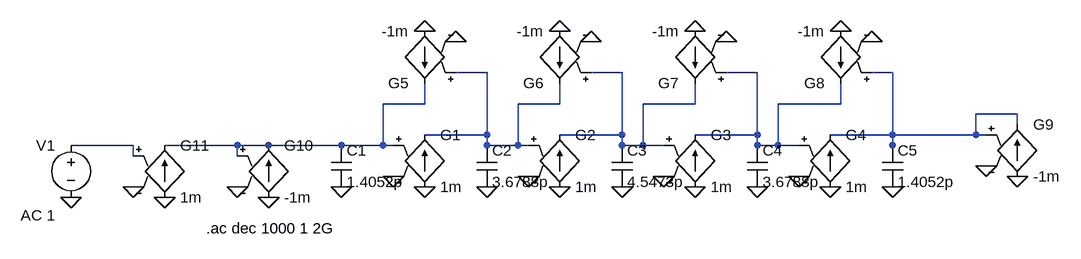
[diagram p0: schematic GmC.asc]
GmC.asc, the LTspice schematic file:
Version 4
SHEET 1 1176 680
WIRE 288 16 240 16
WIRE 496 16 448 16
WIRE 704 16 656 16
WIRE 912 16 880 16
WIRE 192 64 192 32
WIRE 192 64 128 64
WIRE 400 64 400 32
WIRE 400 64 336 64
WIRE 608 64 608 32
WIRE 608 64 528 64
WIRE 832 64 832 32
WIRE 832 64 736 64
WIRE 1104 80 1040 80
WIRE 1104 96 1104 80
WIRE 288 112 288 16
WIRE 288 112 192 112
WIRE 496 112 496 16
WIRE 496 112 400 112
WIRE 704 112 704 16
WIRE 704 112 608 112
WIRE 912 112 912 16
WIRE 912 112 816 112
WIRE 1040 112 1040 80
WIRE 1040 112 912 112
WIRE 1056 112 1040 112
WIRE -256 128 -352 128
WIRE -96 128 -208 128
WIRE -48 128 -96 128
WIRE 64 128 -48 128
WIRE 128 128 128 64
WIRE 128 128 64 128
WIRE 144 128 128 128
WIRE 288 128 288 112
WIRE 336 128 336 64
WIRE 336 128 288 128
WIRE 352 128 336 128
WIRE 496 128 496 112
WIRE 528 128 528 64
WIRE 528 128 496 128
WIRE 560 128 528 128
WIRE 704 128 704 112
WIRE 736 128 736 64
WIRE 736 128 704 128
WIRE 768 128 736 128
WIRE 912 128 912 112
WIRE -256 144 -256 128
WIRE -96 144 -96 128
WIRE 912 144 912 128
FLAG 144 176 0
FLAG 240 -32 0
FLAG 448 -32 0
FLAG 352 176 0
FLAG 656 -32 0
FLAG 880 -32 0
FLAG 768 176 0
FLAG 560 176 0
FLAG 192 192 0
FLAG 400 192 0
FLAG 608 192 0
FLAG 816 192 0
FLAG 832 -48 0
FLAG 608 -48 0
FLAG 400 -48 0
FLAG 192 -48 0
FLAG 64 192 0
FLAG 288 192 0
FLAG 704 192 0
FLAG 912 192 0
FLAG 496 192 0
FLAG -352 208 0
FLAG 1056 160 0
FLAG 1104 176 0
FLAG -256 192 0
FLAG -96 192 0
FLAG -208 208 0
FLAG -48 208 0
SYMBOL cap 48 128 R0
SYMATTR InstName C1
SYMATTR Value 1.4052p
SYMBOL cap 272 128 R0
SYMATTR InstName C2
SYMATTR Value 3.6788p
SYMBOL cap 480 128 R0
SYMATTR InstName C3
SYMATTR Value 4.5473p
SYMBOL g 192 96 R0
SYMATTR InstName G1
SYMATTR Value 1m
SYMBOL g 400 96 R0
SYMATTR InstName G2
SYMATTR Value 1m
SYMBOL g 608 96 R0
SYMATTR InstName G3
SYMATTR Value 1m
SYMBOL cap 688 128 R0
SYMATTR InstName C4
SYMATTR Value 3.6788p
SYMBOL g 816 96 R0
SYMATTR InstName G4
SYMATTR Value 1m
SYMBOL cap 896 128 R0
SYMATTR InstName C5
SYMATTR Value 1.4052p
SYMBOL g 192 48 R180
SYMATTR InstName G5
SYMATTR Value -1m
SYMBOL g 400 48 R180
SYMATTR InstName G6
SYMATTR Value -1m
SYMBOL g 608 48 R180
SYMATTR InstName G7
SYMATTR Value -1m
SYMBOL g 832 48 R180
SYMATTR InstName G8
SYMATTR Value -1m
SYMBOL voltage -352 112 M0
WINDOW 123 24 124 Left 2
WINDOW 39 0 0 Left 0
SYMATTR Value2 AC 1
SYMATTR InstName V1
SYMATTR Value ""
SYMBOL g 1104 80 R0
SYMATTR InstName G9
SYMATTR Value -1m
SYMBOL g -48 112 R0
SYMATTR InstName G10
SYMATTR Value -1m
SYMBOL g -208 112 R0
SYMATTR InstName G11
SYMATTR Value 1m
TEXT -144 256 Left 2 !.ac dec 1000 1 2G

The netlist it stands for:
* GmC.asc
C1 N005 0 1.4052p
C2 N001 0 3.6788p
C3 N002 0 4.5473p
G1 0 N001 N005 0 1m
G2 0 N002 N001 0 1m
G3 0 N003 N002 0 1m
C4 N003 0 3.6788p
G4 0 N004 N003 0 1m
C5 N004 0 1.4052p
G5 0 N005 N001 0 -1m
G6 0 N001 N002 0 -1m
G7 0 N002 N003 0 -1m
G8 0 N003 N004 0 -1m
V1 N006 0 AC 1
G9 0 N004 N004 0 -1m
G10 0 N005 N005 0 -1m
G11 0 N005 N006 0 1m
.ac dec 1000 1 2G
.backanno
.end